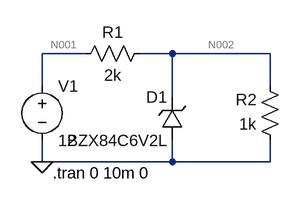
[diagram p0: schematic Practice-2.asc]
Practice-2.asc, the LTspice schematic file:
Version 4
SHEET 1 880 680
WIRE 80 96 16 96
WIRE 208 96 160 96
WIRE 352 96 208 96
WIRE 16 144 16 96
WIRE 352 144 352 96
WIRE 208 160 208 96
WIRE 16 256 16 224
WIRE 208 256 208 224
WIRE 208 256 16 256
WIRE 352 256 352 224
WIRE 352 256 208 256
FLAG 16 256 0
SYMBOL res 176 80 R90
WINDOW 0 0 56 VBottom 2
WINDOW 3 32 56 VTop 2
SYMATTR InstName R1
SYMATTR Value 2k
SYMBOL res 368 240 R180
WINDOW 0 36 76 Left 2
WINDOW 3 36 40 Left 2
SYMATTR InstName R2
SYMATTR Value 1k
SYMBOL voltage 16 128 R0
SYMATTR InstName V1
SYMATTR Value 12
SYMBOL zener 224 224 R180
WINDOW 0 24 64 Left 2
WINDOW 3 24 0 Left 2
SYMATTR InstName D1
SYMATTR Value BZX84C6V2L
TEXT 32 272 Left 2 !.tran 0 10m 0

The netlist it stands for:
* Practice-2.asc
R1 N002 N001 2k
R2 0 N002 1k
V1 N001 0 12
D1 0 N002 BZX84C6V2L
.model D D
.lib standard.dio
.tran 0 10m 0
.backanno
.end

* Results of the author's LTspice run, read from the files saved beside the schematic
* Operating Point, zero values left out:
*   V(n002) = 4 V
*   V(n001) = 12 V
*   I(D1) = -1.504 nA
*   I(R1) = -4 mA
*   I(R2) = -4 mA
*   I(V1) = -4 mA